# Altium schematic sheet DIO-BNC.schdoc: DIO-BNC
size 420 x 297 mm; Author: G.K.; CompanyName: WUT; DrawnBy: G.K.; Organization: CERN; Address1: Warsaw Univeristy of Technology; Address2: Nowowiejska 15/19; DocumentNumber: 1; Revision: -; SheetNumber: 1; SheetTotal: -; EDA_Number: ARTIQ; Projet: KASLI 3U subsystem; ModifiedBy: -; CreateDate: XX/XX/XXXX; CheckedDate: -; Title2: Extension board v1.2; DivGrp: ISE; Designer: G.K.; ModifiedDate: -; ProjectName: KASLI 3U subsystem
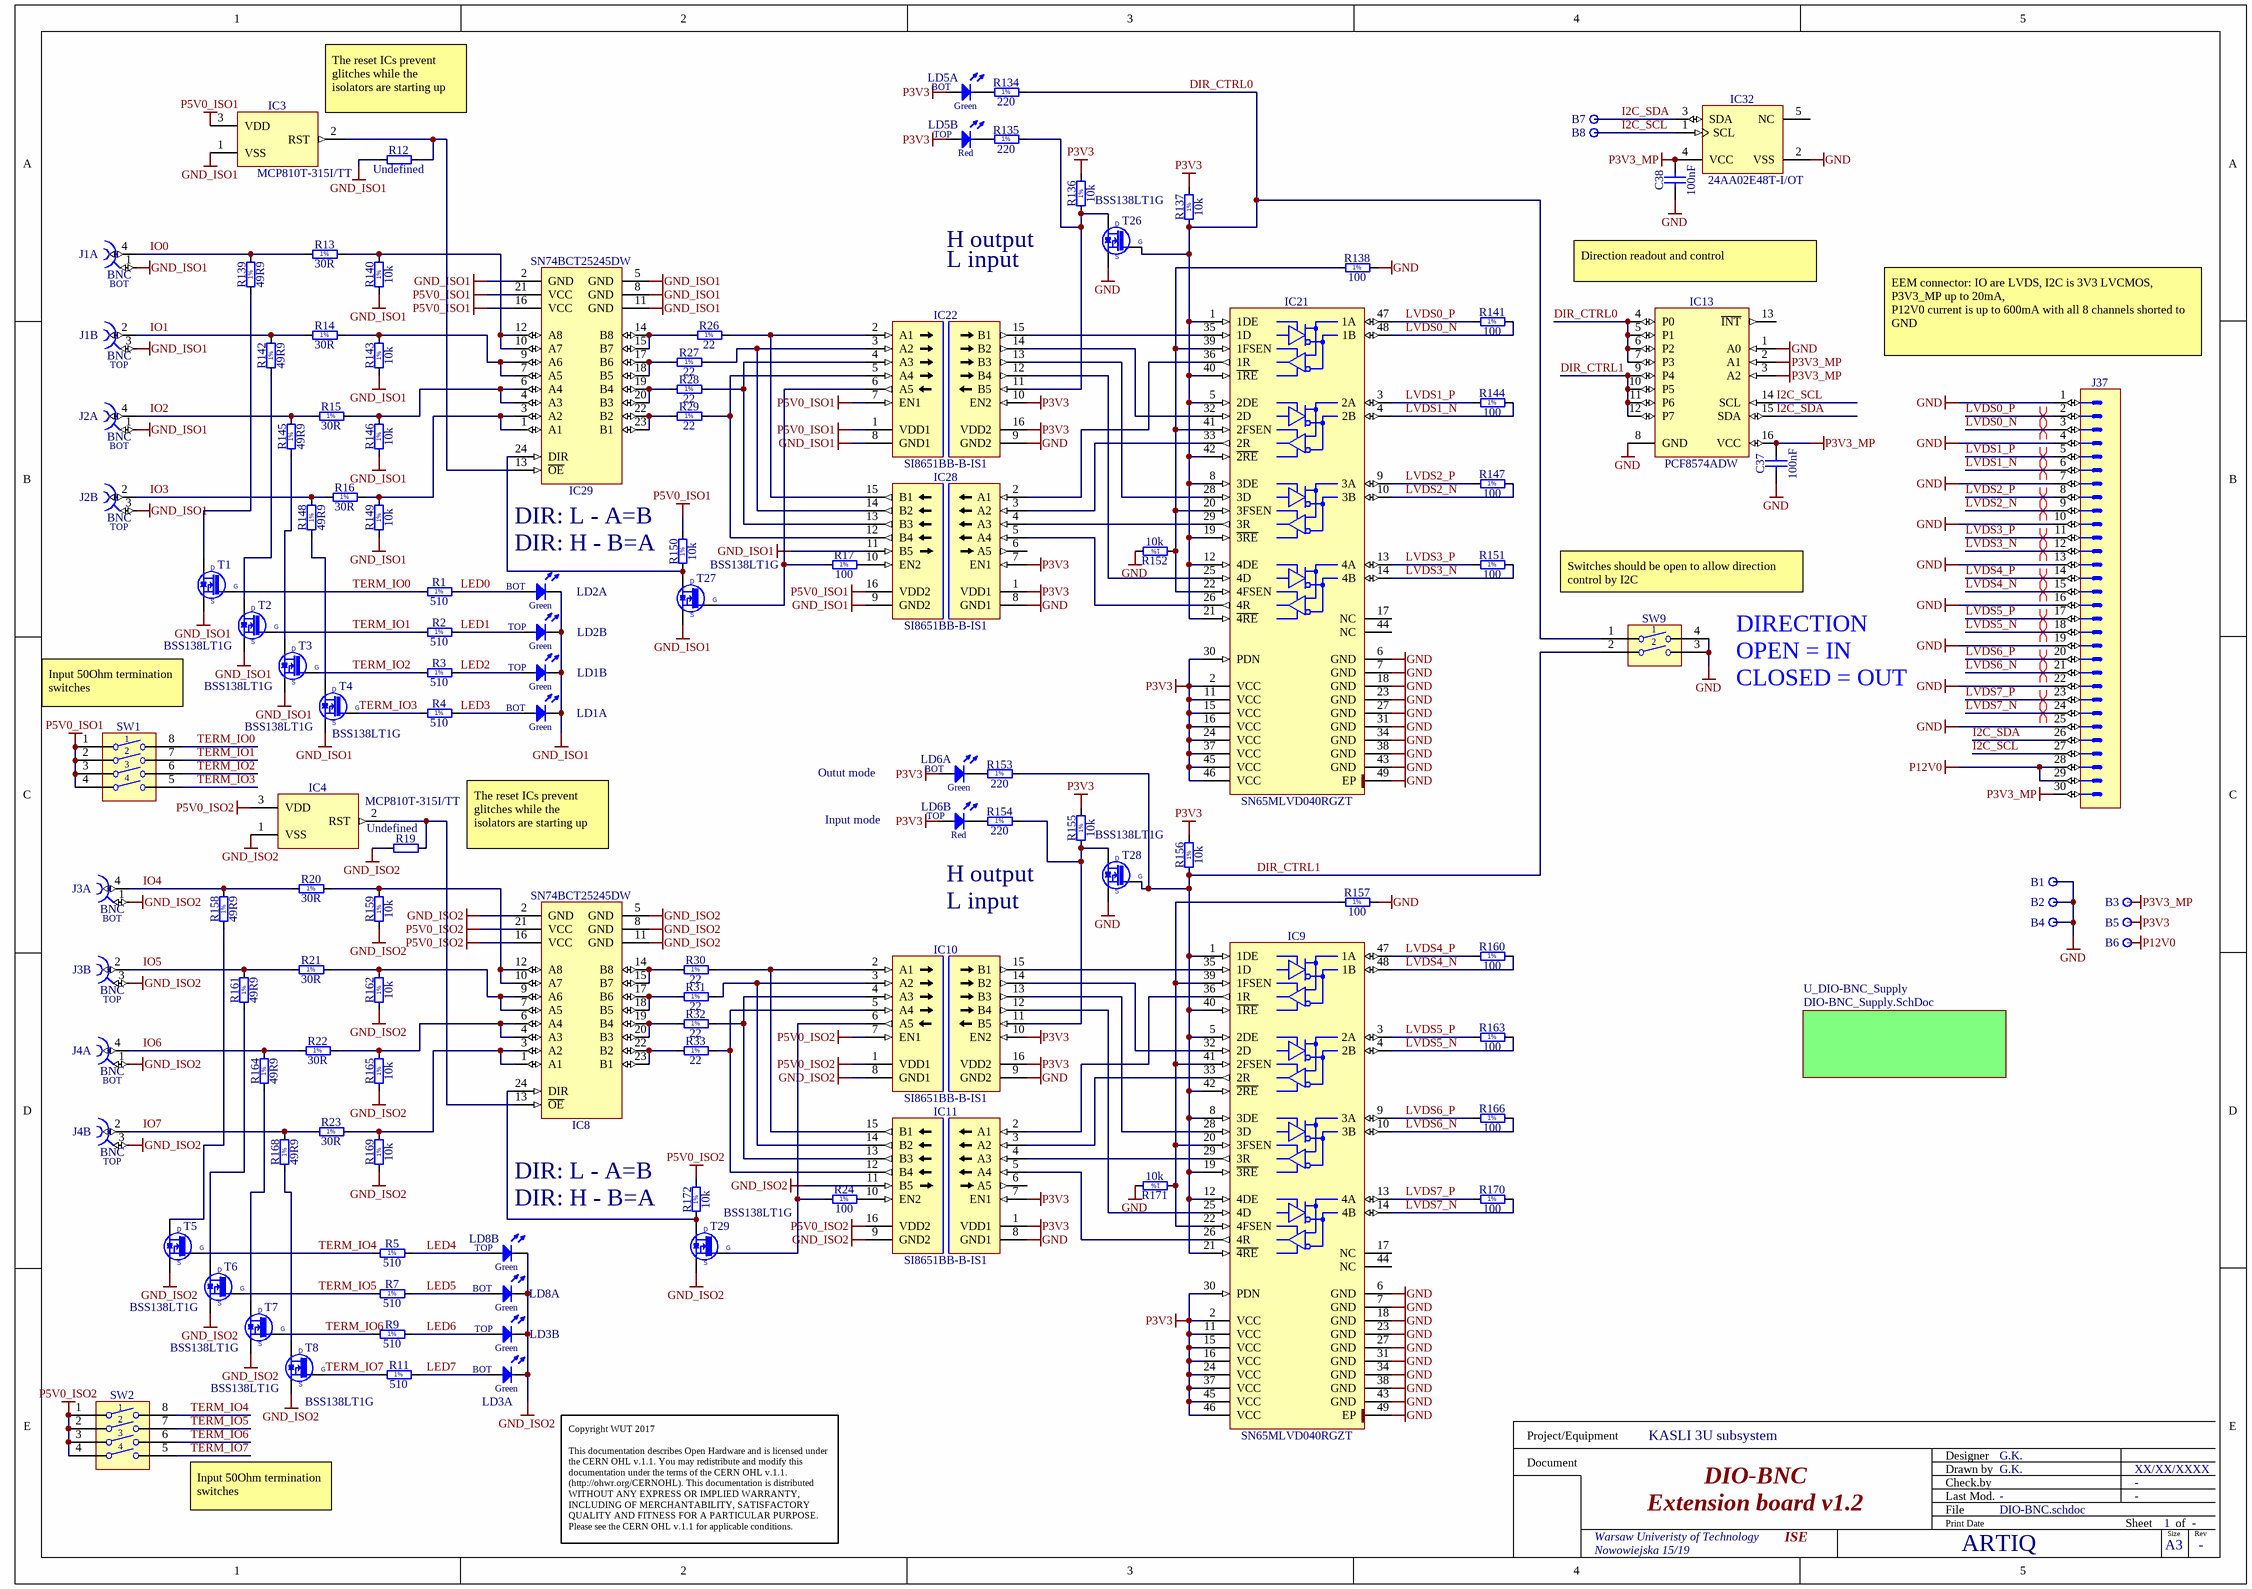
[diagram p0: DIO-BNC.schdoc]

## Parts
B1  Plated Hole  [c130h60]  (value not drawn)
B2  Plated Hole  [c130h60]  (value not drawn)
B3  Plated Hole  [c130h60]  (value not drawn)
B4  Plated Hole  [c130h60]  (value not drawn)
B5  Plated Hole  [c130h60]  (value not drawn)
B6  Plated Hole  [c130h60]  (value not drawn)
B7  Plated Hole  [c130h60]  (value not drawn)
B8  Plated Hole  [c130h60]  (value not drawn)
C37  100nF  [CAPC1005X55N]
C38  100nF  [CAPC1005X55N]
IC3  MCP810T-315I/TT  [SOT95P237X112-3N]
IC4  MCP810T-315I/TT  [SOT95P237X112-3N]
IC8  SN74BCT25245DW  [SOIC127P1030X265-24N]
IC9  SN65MLVD040RGZT  [QFN50P700X700X100-49N-S420]
IC10  SI8651BB-B-IS1  [SOIC127P600X175-16N]
IC11  SI8651BB-B-IS1  [SOIC127P600X175-16N]
IC13  PCF8574ADW  [SOIC127P1030X265-16N]
IC21  SN65MLVD040RGZT  [QFN50P700X700X100-49N-S420]
IC22  SI8651BB-B-IS1  [SOIC127P600X175-16N]
IC28  SI8651BB-B-IS1  [SOIC127P600X175-16N]
IC29  SN74BCT25245DW  [SOIC127P1030X265-24N]
IC32  24AA02E48T-I/OT  [SOT95P280X145-5N]
J1  BNC  [RENHOTEC_RHT-610-0049]  (parts A,B of 2)
J2  BNC  [RENHOTEC_RHT-610-0049]  (parts A,B of 2)
J3  BNC  [RENHOTEC_RHT-610-0049]  (parts A,B of 2)
J4  BNC  [RENHOTEC_RHT-610-0049]  (parts A,B of 2)
J37  (no value)  [3M_N2530-6002RB]
LD1  Green/Green  [LED_DIALIGHT_571-0122F]  (value not drawn)  (parts A,B of 2)
LD2  Green/Green  [LED_DIALIGHT_571-0122F]  (value not drawn)  (parts A,B of 2)
LD3  Green/Green  [LED_DIALIGHT_571-0122F]  (value not drawn)  (parts A,B of 2)
LD5  Red/Green  [LED_DIALIGHT_571-0112F]  (value not drawn)  (parts A,B of 2)
LD6  Red/Green  [LED_DIALIGHT_571-0112F]  (value not drawn)  (parts A,B of 2)
LD8  Green/Green  [LED_DIALIGHT_571-0122F]  (value not drawn)  (parts A,B of 2)
R1  510  [RESC1005X40N]
R2  510  [RESC1005X40N]
R3  510  [RESC1005X40N]
R4  510  [RESC1005X40N]
R5  510  [RESC1005X40N]
R7  510  [RESC1005X40N]
R9  510  [RESC1005X40N]
R11  510  [RESC1005X40N]
R12  Undefined  [RESC1005X40N]
R13  30R  [RESC3225X70N]
R14  30R  [RESC3225X70N]
R15  30R  [RESC3225X70N]
R16  30R  [RESC3225X70N]
R17  100  [RESC1005X40N]
R19  Undefined  [RESC1005X40N]
R20  30R  [RESC3225X70N]
R21  30R  [RESC3225X70N]
R22  30R  [RESC3225X70N]
R23  30R  [RESC3225X70N]
R24  100  [RESC1005X40N]
R26  22  [RESC1005X40N]
R27  22  [RESC1005X40N]
R28  22  [RESC1005X40N]
R29  22  [RESC1005X40N]
R30  22  [RESC1005X40N]
R31  22  [RESC1005X40N]
R32  22  [RESC1005X40N]
R33  22  [RESC1005X40N]
R134  220  [RESC1608X55N]
R135  220  [RESC1608X55N]
R136  10k  [RESC1005X40N]
R137  10k  [RESC1005X40N]
R138  100  [RESC1005X40N]
R139  49R9  [RESC3225X70N]
R140  10k  [RESC1005X40N]
R141  100  [RESC1005X40N]
R142  49R9  [RESC3225X70N]
R143  10k  [RESC1005X40N]
R144  100  [RESC1005X40N]
R145  49R9  [RESC3225X70N]
R146  10k  [RESC1005X40N]
R147  100  [RESC1005X40N]
R148  49R9  [RESC3225X70N]
R149  10k  [RESC1005X40N]
R150  10k  [RESC1005X40N]
R151  100  [RESC1005X40N]
R152  10k  [RESC1005X40N]
R153  220  [RESC1608X55N]
R154  220  [RESC1608X55N]
R155  10k  [RESC1005X40N]
R156  10k  [RESC1005X40N]
R157  100  [RESC1005X40N]
R158  49R9  [RESC3225X70N]
R159  10k  [RESC1005X40N]
R160  100  [RESC1005X40N]
R161  49R9  [RESC3225X70N]
R162  10k  [RESC1005X40N]
R163  100  [RESC1005X40N]
R164  49R9  [RESC3225X70N]
R165  10k  [RESC1005X40N]
R166  100  [RESC1005X40N]
R168  49R9  [RESC3225X70N]
R169  10k  [RESC1005X40N]
R170  100  [RESC1005X40N]
R171  10k  [RESC1005X40N]
R172  10k  [RESC1005X40N]
SW1  Switch  [SW_OMRON_A6S-4102-H]  (value not drawn)
SW2  Switch  [SW_OMRON_A6S-4102-H]  (value not drawn)
SW9  Switch  [SW_OMRON_A6S-2102-H]  (value not drawn)
T1  BSS138LT1G  [SOT95P240X110-3N]
T2  BSS138LT1G  [SOT95P240X110-3N]
T3  BSS138LT1G  [SOT95P240X110-3N]
T4  BSS138LT1G  [SOT95P240X110-3N]
T5  BSS138LT1G  [SOT95P240X110-3N]
T6  BSS138LT1G  [SOT95P240X110-3N]
T7  BSS138LT1G  [SOT95P240X110-3N]
T8  BSS138LT1G  [SOT95P240X110-3N]
T26  BSS138LT1G  [SOT95P240X110-3N]
T27  BSS138LT1G  [SOT95P240X110-3N]
T28  BSS138LT1G  [SOT95P240X110-3N]
T29  BSS138LT1G  [SOT95P240X110-3N]

## Sub-sheets
U_DIO-BNC_Supply = DIO-BNC_Supply.SchDoc: no entries

## Nets
GND: B1.1 B2.1 B4.1 C37.1 C38.1 IC9.6(GND) IC9.7(GND) IC9.18(GND) IC9.23(GND) IC9.27(GND) IC9.31(GND) IC9.34(GND) IC9.38(GND) IC9.43(GND) IC9.49(EP) IC10.9(GND2) IC11.8(GND1) IC13.1(A0) IC13.8(GND) IC21.6(GND) IC21.7(GND) IC21.18(GND) IC21.23(GND) IC21.27(GND) IC21.31(GND) IC21.34(GND) IC21.38(GND) IC21.43(GND) IC21.49(EP) IC22.9(GND2) IC28.8(GND1) IC32.2(VSS) J37.1 J37.4 J37.7 J37.10 J37.13 J37.16 J37.19 J37.22 J37.25 R138.2 R152.2 R157.2 R171.2 SW9.3 SW9.4 T26.2(S) T28.2(S)
GND_ISO1: IC3.1(VSS) IC22.8(GND1) IC28.9(GND2) IC28.11(B5) IC29.2(GND) IC29.5(GND) IC29.8(GND) IC29.11(GND) J1.1 J1.3 J2.1 J2.3 LD1.1(C) LD1.3(C) LD2.1(C) LD2.3(C) R12.1 R140.1 R143.1 R146.1 R149.1 T1.2(S) T2.2(S) T3.2(S) T4.2(S) T27.2(S)
GND_ISO2: IC4.1(VSS) IC8.2(GND) IC8.5(GND) IC8.8(GND) IC8.11(GND) IC10.8(GND1) IC11.9(GND2) IC11.11(B5) J3.1 J3.3 J4.1 J4.3 LD3.1(C) LD3.3(C) LD8.1(C) LD8.3(C) R19.1 R159.1 R162.1 R165.1 R169.1 T5.2(S) T6.2(S) T7.2(S) T8.2(S) T29.2(S)
P3V3: B5.1 IC9.2(VCC) IC9.11(VCC) IC9.15(VCC) IC9.16(VCC) IC9.24(VCC) IC9.30(PDN) IC9.37(VCC) IC9.45(VCC) IC9.46(VCC) IC10.10(EN2) IC10.16(VDD2) IC11.1(VDD1) IC11.7(EN1) IC21.2(VCC) IC21.11(VCC) IC21.15(VCC) IC21.16(VCC) IC21.24(VCC) IC21.30(PDN) IC21.37(VCC) IC21.45(VCC) IC21.46(VCC) IC22.10(EN2) IC22.16(VDD2) IC28.1(VDD1) IC28.7(EN1) LD5.2(A) LD5.4(A) LD6.2(A) LD6.4(A) R136.2 R137.2 R155.2 R156.2
P3V3_MP: B3.1 C37.2 C38.2 IC13.2(A1) IC13.3(A2) IC13.16(VCC) IC32.4(VCC) J37.30
P5V0_ISO1: IC3.3(VDD) IC22.1(VDD1) IC22.7(EN1) IC28.16(VDD2) IC29.16(VCC) IC29.21(VCC) R150.2 SW1.1 SW1.2 SW1.3 SW1.4
P5V0_ISO2: IC4.3(VDD) IC8.16(VCC) IC8.21(VCC) IC10.1(VDD1) IC10.7(EN1) IC11.16(VDD2) R172.2 SW2.1 SW2.2 SW2.3 SW2.4
P12V0: B6.1 J37.28 J37.29
DIR_CTRL0: IC13.4(P0) IC13.5(P1) IC13.6(P2) IC13.7(P3) IC21.1(1DE) IC21.5(2DE) IC21.8(3DE) IC21.12(4DE) IC21.19(~{3RE}) IC21.21(~{4RE}) IC21.40(~{1RE}) IC21.42(~{2RE}) R134.2 R137.1 SW9.1 T26.1(G)
DIR_CTRL1: IC9.1(1DE) IC9.5(2DE) IC9.8(3DE) IC9.12(4DE) IC9.19(~{3RE}) IC9.21(~{4RE}) IC9.40(~{1RE}) IC9.42(~{2RE}) IC13.9(P4) IC13.10(P5) IC13.11(P6) IC13.12(P7) R153.2 R156.1 SW9.2 T28.1(G)
I2C_SCL: B8.1 IC13.14(SCL) IC32.1(SCL) J37.27
I2C_SDA: B7.1 IC13.15(SDA) IC32.3(SDA) J37.26
IO0: J1.4 R13.1 R139.2
IO1: J1.2 R14.1 R142.2
IO2: J2.4 R15.1 R145.2
IO3: J2.2 R16.1 R148.2
IO4: J3.4 R20.1 R158.2
IO5: J3.2 R21.1 R161.2
IO6: J4.4 R22.1 R164.2
IO7: J4.2 R23.1 R168.2
LED0: LD2.2(A) R1.2
LED1: LD2.4(A) R2.2
LED2: LD1.4(A) R3.2
LED3: LD1.2(A) R4.2
LED4: LD8.4(A) R5.2
LED5: LD8.2(A) R7.2
LED6: LD3.4(A) R9.2
LED7: LD3.2(A) R11.2
LVDS0_N: IC21.48(1B) J37.3 R141.2
LVDS0_P: IC21.47(1A) J37.2 R141.1
LVDS1_N: IC21.4(2B) J37.6 R144.2
LVDS1_P: IC21.3(2A) J37.5 R144.1
LVDS2_N: IC21.10(3B) J37.9 R147.2
LVDS2_P: IC21.9(3A) J37.8 R147.1
LVDS3_N: IC21.14(4B) J37.12 R151.2
LVDS3_P: IC21.13(4A) J37.11 R151.1
LVDS4_N: IC9.48(1B) J37.15 R160.2
LVDS4_P: IC9.47(1A) J37.14 R160.1
LVDS5_N: IC9.4(2B) J37.18 R163.2
LVDS5_P: IC9.3(2A) J37.17 R163.1
LVDS6_N: IC9.10(3B) J37.21 R166.2
LVDS6_P: IC9.9(3A) J37.20 R166.1
LVDS7_N: IC9.14(4B) J37.24 R170.2
LVDS7_P: IC9.13(4A) J37.23 R170.1
TERM_IO0: R1.1 SW1.8 T1.1(G)
TERM_IO1: R2.1 SW1.7 T2.1(G)
TERM_IO2: R3.1 SW1.6 T3.1(G)
TERM_IO3: R4.1 SW1.5 T4.1(G)
TERM_IO4: R5.1 SW2.8 T5.1(G)
TERM_IO5: R7.1 SW2.7 T6.1(G)
TERM_IO6: R9.1 SW2.6 T7.1(G)
TERM_IO7: R11.1 SW2.5 T8.1(G)
NetIC3_2: IC3.2(RST) IC29.13(~{OE}) R12.2
NetIC4_2: IC4.2(RST) IC8.13(~{OE}) R19.2
NetIC8_1: IC8.1(A1) IC8.3(A2) R23.2 R169.2
NetIC8_4: IC8.4(A3) IC8.6(A4) R22.2 R165.2
NetIC8_7: IC8.7(A5) IC8.9(A6) R21.2 R162.2
NetIC8_10: IC8.10(A7) IC8.12(A8) R20.2 R159.2
NetIC8_14: IC8.14(B8) IC8.15(B7) R30.1
NetIC8_17: IC8.17(B6) IC8.18(B5) R31.1
NetIC8_19: IC8.19(B4) IC8.20(B3) R32.1
NetIC8_22: IC8.22(B2) IC8.23(B1) R33.1
NetIC8_24: IC8.24(DIR) R172.1 T29.3(D)
NetIC9_20: IC9.20(3FSEN) IC9.22(4FSEN) IC9.39(1FSEN) IC9.41(2FSEN) R157.1 R171.1
NetIC9_25: IC9.25(4D) IC10.12(B4)
NetIC9_26: IC9.26(4R) IC11.5(A4)
NetIC9_28: IC9.28(3D) IC10.13(B3)
NetIC9_29: IC9.29(3R) IC11.4(A3)
NetIC9_32: IC9.32(2D) IC10.14(B2)
NetIC9_33: IC9.33(2R) IC11.3(A2)
NetIC9_35: IC9.35(1D) IC10.15(B1)
NetIC9_36: IC9.36(1R) IC11.2(A1)
NetIC10_2: IC10.2(A1) IC11.15(B1) R30.2
NetIC10_3: IC10.3(A2) IC11.14(B2) R31.2
NetIC10_4: IC10.4(A3) IC11.13(B3) R32.2
NetIC10_5: IC10.5(A4) IC11.12(B4) R33.2
NetIC10_6: IC10.6(A5) R24.1 T29.1(G)
NetIC10_11: IC10.11(B5) R154.2 R155.1 T28.3(D)
NetIC11_10: IC11.10(EN2) R24.2
NetIC21_20: IC21.20(3FSEN) IC21.22(4FSEN) IC21.39(1FSEN) IC21.41(2FSEN) R138.1 R152.1
NetIC21_25: IC21.25(4D) IC22.12(B4)
NetIC21_26: IC21.26(4R) IC28.5(A4)
NetIC21_28: IC21.28(3D) IC22.13(B3)
NetIC21_29: IC21.29(3R) IC28.4(A3)
NetIC21_32: IC21.32(2D) IC22.14(B2)
NetIC21_33: IC21.33(2R) IC28.3(A2)
NetIC21_35: IC21.35(1D) IC22.15(B1)
NetIC21_36: IC21.36(1R) IC28.2(A1)
NetIC22_2: IC22.2(A1) IC28.15(B1) R26.2
NetIC22_3: IC22.3(A2) IC28.14(B2) R27.2
NetIC22_4: IC22.4(A3) IC28.13(B3) R28.2
NetIC22_5: IC22.5(A4) IC28.12(B4) R29.2
NetIC22_6: IC22.6(A5) R17.1 T27.1(G)
NetIC22_11: IC22.11(B5) R135.2 R136.1 T26.3(D)
NetIC28_10: IC28.10(EN2) R17.2
NetIC29_1: IC29.1(A1) IC29.3(A2) R16.2 R149.2
NetIC29_4: IC29.4(A3) IC29.6(A4) R15.2 R146.2
NetIC29_7: IC29.7(A5) IC29.9(A6) R14.2 R143.2
NetIC29_10: IC29.10(A7) IC29.12(A8) R13.2 R140.2
NetIC29_14: IC29.14(B8) IC29.15(B7) R26.1
NetIC29_17: IC29.17(B6) IC29.18(B5) R27.1
NetIC29_19: IC29.19(B4) IC29.20(B3) R28.1
NetIC29_22: IC29.22(B2) IC29.23(B1) R29.1
NetIC29_24: IC29.24(DIR) R150.1 T27.3(D)
NetLD5_1: LD5.1(C) R134.1
NetLD5_3: LD5.3(C) R135.1
NetLD6_1: LD6.1(C) R153.1
NetLD6_3: LD6.3(C) R154.1
NetR139_1: R139.1 T1.3(D)
NetR142_1: R142.1 T2.3(D)
NetR145_1: R145.1 T3.3(D)
NetR148_1: R148.1 T4.3(D)
NetR158_1: R158.1 T5.3(D)
NetR161_1: R161.1 T6.3(D)
NetR164_1: R164.1 T7.3(D)
NetR168_1: R168.1 T8.3(D)

Not connected (* = marked no-connect by the designer): IC9 17(NC) 44(NC); IC11 6(A5); IC13 13(~{INT}); IC21 17(NC) 44(NC); IC28 6(A5); IC32 5(NC)

## Layout directives
differential pair: LVDS0_N, LVDS0_P, LVDS1_N, LVDS1_P, LVDS2_N, LVDS2_P, LVDS3_N, LVDS3_P, LVDS4_N, LVDS4_P, LVDS5_N, LVDS5_P, LVDS6_N, LVDS6_P, LVDS7_N, LVDS7_P

## Notes on the sheet
- (near IC3) The reset ICs prevent glitches while the isolators are starting up
- H output
- L input
- Direction readout and control
- (near J37) EEM connector: IO are LVDS, I2C is 3V3 LVCMOS, P3V3_MP up to 20mA,
  P12V0 current is up to 600mA with all 8 channels shorted to GND
- DIR: L - A=B
- DIR: H - B=A
- Switches should be open to allow direction control by I2C
- DIRECTION
- OPEN = IN
- (near SW1) Input 50Ohm termination switches
- CLOSED = OUT
- Outut mode
- The reset ICs prevent glitches while the isolators are starting up
- Input mode
- (near SW2) Input 50Ohm termination switches
- Copyright WUT 2017
  This documentation describes Open Hardware and is licensed under the CERN OHL v.1.1. You may redistribute and modify this documentation under the terms of the CERN OHL v.1.1. (http://ohwr.org/CERNOHL). This documentation is distributed WITHOUT ANY EXPRESS OR IMPLIED WARRANTY, INCLUDING OF MERCHANTABILITY, SATISFACTORY QUALITY AND FITNESS FOR A PARTICULAR PURPOSE. Please see the CERN OHL v.1.1 for applicable conditions.
- Project/Equipment
- Document
- Designer
- Drawn by
- Check.by
- File
- Last Mod.
- Print Date
- Sheet
- Size
- A3
- of
- Rev
- (in symbol CON_BNC_DUAL, part A) BOT
- (in symbol CON_BNC_DUAL, part B) TOP
- (in symbol LED_DIALIGHT_571-0112F, part A) BOT; Green
- (in symbol LED_DIALIGHT_571-0112F, part B) TOP; Red
- (in symbol LED_DIALIGHT_571-0122F, part A) BOT; Green
- (in symbol LED_DIALIGHT_571-0122F, part B) TOP; Green
- (in symbol R0402_10K_1%_0.0625W_100PPM) 1%
- (in symbol R0402_22R_1%_0.0625W_100PPM) 1%
- (in symbol R0402_100R_1%_0.1W_100PPM) 1%
- (in symbol R0402_510R_1%_0.0625W_100PPM) 1%
- (in symbol R0603_220R_1%_0.1W_100PPM) 1%
- (in symbol R1210_30R_5%_0.5W_200PPM) 1%
- (in symbol R1210_49R9_1%_0.5W_100PPM_VISHAY_CRCW) 1%

## Library data of the parts
B1-B8 = PLATED_HOLE0.6_PAD1.3: Single Terminal Socket; Part Description: Plated Through Hole: Hole Dia.=0.6mm Pad Dia.=1.3mm; Mounted: No; Part Number: PLATED_HOLE0.6_PAD1.3; Component Kind: Standard (No BOM); Component Type: Standard (No BOM); Pin Count: 1; Family: Plated Hole; Socket: No; SMD: No; Sense: No; Status: None; ComponentHeight: 0mm; HelpURL: Undefined; Author: CERN DEM MR; CreateDate: 02.03.2016; LatestRevisionDate: 02.03.2016; PackageDescription: Plated Through Hole: Hole Dia.=0.6mm Pad Dia.=1.3mm
C37 C38 = CC0402_100NF_16V_10%_X5R: Non-polarised capacitor; Part Description: SMD Multilayer Chip Ceramic Capacitor; Manufacturer: GENERIC; Manufacturer1 Part Number: GRM155R61C104KA88D; Voltage: 16V; TC: X5R; Tolerance: ±10%; Part Number: CC0402_100NF_16V_10%_X5R; Component Kind: Standard; Component Type: Standard; Pin Count: 2; Value: 100nF; Status: None; Manufacturer Part Number: CC0402_100NF_16V_10%_X5R; Case: 0402; Mounted: Yes; Socket: No; SMD: Yes; Sense: No; Manufacturer1 Example: MURATA; Manufacturer1 ComponentHeight: 0.55mm; HelpURL: \\cern.ch\dfs\Applications\Altium\Datasheets\CC0402_X5R_MURATA_GRM.pdf; Author: CERN DEM JLC; CreateDate: 10.12.2013; LatestRevisionDate: 10.12.2013
IC3 IC4 = VMON_MCP810: 3.075V Microcontroller Supervisory Circuit With Push-Pull Output; Manufacturer: MICROCHIP TECHNOLOGY; PressFit: No; Bonding: No; Part Number: MCP810T-315I/TT; Component Kind: Standard; Component Type: Standard; Device: MCP810T-315I/TT; PackageDescription: SOT, 0.95mm, pitch; 3 pin,1.30mm W X 2.92mm L X 1.12mm H body, IPC Medium Density; Part Description: 3.075V Microcontroller Supervisory Circuit With Push-Pull Output; Manufacturer Part Number: MCP810T-315I/TT; Pin Count: 3; Case: SOT23; Mounted: Yes; Socket: No; SMD: Yes; Sense: No; ComponentHeight: 1.12mm; Author: GK; HelpURL: \\cern.ch\dfs\Applications\Altium\Datasheets\MCP809T-315I-TT.pdf; CreateDate: 16.06.2011; LatestRevisionDate: 16.06.2011
IC8 IC29 = SN74BCT25245DW: 25 Ohms Octal Bus Transceiver With 3-State Outputs; Manufacturer: TEXAS INSTRUMENTS; PressFit: No; Bonding: No; Part Number: SN74BCT25245DW; Component Kind: Standard; Component Type: Standard; Device: SN74BCT25245DW; PackageDescription: SOIC 24, Pitch 1.27mm - Body 7.6x15.6mm, IPC Medium Density; Part Description: 25 Ohms Octal Bus Transceiver With 3-State Outputs; Manufacturer Part Number: SN74BCT25245DW; Pin Count: 24; Case: SOIC24; Mounted: Yes; Socket: No; SMD: Yes; Sense: No; ComponentHeight: 2.65mm; Author: CERN DEM JLC; HelpURL: \\cern.ch\dfs\Applications\Altium\Datasheets\SN74BCT25245DW.pdf; CreateDate: 09.11.2009; LatestRevisionDate: 09.11.2009
IC9 IC21 = SN65MLVD040RGZT: 4-Channel Half-Duplex M-LVDS Line Transceiver; Manufacturer: TEXAS INSTRUMENTS; PressFit: No; Bonding: No; Part Number: SN65MLVD040RGZT; Component Kind: Standard; Component Type: Standard; Device: SN65MLVD040RGZT; PackageDescription: QFN, 0.50mm Pitch, Square; 48 Pin, 7.00mm L X 7.00mm W X 1mm H body (W/Thermal Tab 4.2mm X 4.2mm), IPC Medium Density; Part Description: 4-Channel Half-Duplex M-LVDS Line Transceiver; Manufacturer Part Number: SN65MLVD040RGZT; Pin Count: 49; Case: QFN48; Mounted: Yes; Socket: No; SMD: Yes; Sense: No; ComponentHeight: 1mm; Author: CERN DEM JLC; HelpURL: \\cern.ch\dfs\Applications\Altium\Datasheets\SN65MLVD040RGZT.pdf; CreateDate: 17.03.2011; LatestRevisionDate: 17.03.2011
IC10 IC11 IC22 IC28 = SI8651BB-B-IS1: Low Power Five-Channel Digital Isolator; Part Description: 2.5kV 150Mbps Low Power Five-Channel Digital Isolator; Manufacturer: SILICON LABS; PressFit: No; Bonding: No; Part Number: SI8651BB-B-IS1; Component Kind: Standard; Component Type: Standard; Device: SI8651BB-B-IS1; PackageDescription: SOIC 16, Pitch 1.27mm - Body 4x10mm, IPC Medium Density; Manufacturer Part Number: SI8651BB-B-IS1; Pin Count: 16; Case: SOIC16; Mounted: Yes; Socket: No; SMD: Yes; Sense: No; ComponentHeight: 1.75mm; Author: CERN DEM JLC; HelpURL: \\cern.ch\dfs\Applications\Altium\Datasheets\SI8651BB-B-IS1.pdf; CreateDate: 31.10.2013; LatestRevisionDate: 31.10.2013
IC13 = PCF8574ADW: Remote 8-bit I/O Expander For I2C Bus; Manufacturer: TEXAS INSTRUMENTS; PressFit: No; Bonding: No; Part Number: PCF8574ADW; Component Kind: Standard; Component Type: Standard; Device: PCF8574ADW; PackageDescription: SOIC 16, Pitch 1.27mm - Body 7.5x10.3mm, IPC Medium Density; Part Description: Remote 8-bit I/O Expander For I2C Bus; Manufacturer Part Number: PCF8574ADW; Pin Count: 16; Case: SOIC16W; Mounted: Yes; Socket: No; SMD: Yes; Sense: No; ComponentHeight: 2.65mm; Author: CERN DEM JLC; HelpURL: \\cern.ch\dfs\Applications\Altium\Datasheets\PCF8574ADW.pdf; CreateDate: 01.11.2012; LatestRevisionDate: 01.11.2012
IC32 = 24AA02E48T-I/OT: 1.7V-5.5V, 2K I2C Serial EEPROM With EUI-48 Node Identity; Manufacturer: MICROCHIP TECHNOLOGY; PressFit: No; Bonding: No; Part Number: 24AA02E48T-I/OT; Component Kind: Standard; Component Type: Standard; Device: 24AA02E48T-I/OT; PackageDescription: SOT, 0.95mm pitch; 5 pin, 1.60mm W X 2.90mm L X 1.45mm H body, IPC Medium Density; Part Description: 1.7V-5.5V, 2K I2C Serial EEPROM With EUI-48 Node Identity; Manufacturer Part Number: 24AA02E48T-I/OT; Pin Count: 5; Case: SOT23-5; Mounted: Yes; Socket: No; SMD: Yes; Sense: No; ComponentHeight: 1.45mm; HelpURL: \\cern.ch\dfs\Applications\Altium\Datasheets\24AA02E48T-I-OT.pdf; Author: CERN DEM MR; CreateDate: 31.03.2016; LatestRevisionDate: 31.03.2016
J1-J4 = CON_BNC_DUAL: Dual Right Angle 50 Ohm BNC Jack, White Valox Case; Manufacturer: RENHOTEC; Manufacturer Part Number: RHT-610-0049; PressFit: No; Part Number: RENHOTEC_RHT-610-0049; Component Kind: Standard; Component Type: Standard; Pin Count: 6; Family: BNC; Mounted: Yes; Socket: No; SMD: No; Sense: No; Status: None; Part Description: Dual Right Angle 50 Ohm BNC Jack, White Valox Case; ComponentHeight: 29.3mm; HelpURL: \\cern.ch\dfs\Applications\Altium\Datasheets\BOMAR_364A2595.pdf; Author: GK; CreateDate: 09.04.2013; LatestRevisionDate: 09.04.2013
J37 = 3M_N2530-6002RB: Connector 30 Male; Part Description: 30 Contacts - Straight .100'' x .100'' Low Profile Four-Wall Header, 2500 Series; Manufacturer: 3M; PressFit: No; Part Number: 3M_N2530-6002RB; Component Kind: Standard; Component Type: Standard; Pin Count: 30; Family: Header 30; Mounted: Yes; Socket: No; SMD: No; Sense: No; Status: None; Manufacturer Part Number: N2530-6002RB; ComponentHeight: 10.03mm; HelpURL: \\cern.ch\dfs\Applications\Altium\Datasheets\3M_N2530-6002RB.pdf; Author: CERN DEM JLC; CreateDate: 11.02.2009; LatestRevisionDate: 11.08.2009
LD1-LD3 LD8 = LED_DIALIGHT_571-0122F: LED x2 Green 1C2A-BOT_3C4A-TOP; Part Description: Dual 2mm Green LEDs CBI® Circuit Board Indicator (Without positioning pins); PressFit: No; Bonding: No; Part Number: LED_DIALIGHT_571-0122F; Component Kind: Standard; Component Type: Standard; Color: Green/Green; PackageDescription: 2x 2mm Red LED PCB Edge Mounting (Without positioning pins) DIALIGHT 571 Serie; Manufacturer: DIALIGHT; Manufacturer Part Number: 571-0122F; Pin Count: 4; Mounted: Yes; Socket: No; SMD: No; Sense: No; ComponentHeight: 8.6mm; HelpURL: \\cern.ch\dfs\Applications\Altium\Datasheets\LED_DIALIGHT_571-0122F.pdf; Author: CERN DEM JLC; CreateDate: 09.11.2009; LatestRevisionDate: 17.03.2010
LD5 LD6 = LED_DIALIGHT_571-0112F: 2x LED  Botom Green, Top Red; Part Description: Dual 2mm  LEDs, Red Top,Green Bot, CBI® Circuit Board Indicator (Without positioning pins); PressFit: No; Bonding: No; Part Number: LED_DIALIGHT_571-0112F; Component Kind: Standard; Component Type: Standard; Color: Red/Green; PackageDescription: 2x 2mm LED (Top: Red, Bot: Green) PCB Edge Mounting (Without positioning pins) DIALIGHT 571 Serie; Manufacturer: DIALIGHT; Manufacturer Part Number: 571-0112F; Pin Count: 4; Mounted: Yes; Socket: No; SMD: No; Sense: No; ComponentHeight: 8.6mm; HelpURL: \\cern.ch\dfs\Applications\Altium\Datasheets\LED_DIALIGHT_571-0112F.pdf; Author: CERN DEM JLC; CreateDate: 09.11.2009; LatestRevisionDate: 17.03.2010
R1-R5 R7 R9 R11 = R0402_510R_1%_0.0625W_100PPM: Resistor - 1%; Part Description: General Purpose Thick Film Chip Resistor; Manufacturer: GENERIC; Manufacturer1 Part Number: 232270675101L; TC: ±100ppm/°C; Part Number: R0402_510R_1%_0.0625W_100PPM; Component Kind: Standard; Component Type: Standard; Pin Count: 2; Value: 510; Status: Not recommended; Power: 0.0625W; Tolerance: ±1%; Manufacturer Part Number: R0402_510R_1%_0.0625W_100PPM; Case: 0402; Mounted: Yes; Sense: No; Socket: No; SMD: Yes; Manufacturer1 Example: YAGEO PHYCOMP; Manufacturer1 ComponentHeight: 0.4mm; HelpURL: \\cern.ch\dfs\Applications\Altium\Datasheets\R0402_Phycomp_RC0402.pdf; Author: CERN DEM JLC; CreateDate: 03.12.2007; LatestRevisionDate: 17.10.2012
R12 R19 = R0402_NO-VALUE: Resistor; Part Description: Reserved Footprint For a 0402 (1005) Chip Resistor; PressFit: No; Mounted: No; Part Number: R0402_NO-VALUE; Component Kind: Standard; Component Type: Standard; Pin Count: 2; Value: Undefined; Status: None; Manufacturer: Undefined; Manufacturer Part Number: R0402_NO-VALUE; Case: 0402; Sense: No; Socket: No; SMD: Yes; Manufacturer1 Example: Undefined; Manufacturer1 Part Number: Undefined; Manufacturer1 ComponentHeight: Undefined; HelpURL: Undefined; Author: CERN DEM JLC; CreateDate: 03.12.2007; LatestRevisionDate: 13.03.2008
R13-R16 R20-R23 = R1210_30R_5%_0.5W_200PPM: Resistor - 5%; Part Description: Thick Film Chip Resistor; Manufacturer: VISHAY; Manufacturer Part Number: CRCW121030R0JNEA; Power: 0.5W; TC: ±200ppm/°C; PressFit: No; Part Number: R1210_30R_5%_0.5W_200ppm; Component Kind: Standard; Component Type: Standard; Pin Count: 2; Value: 30R; Status: None; Tolerance: ±5%; Case: 1210; Mounted: Yes; Sense: No; Socket: No; SMD: Yes; HelpURL: \\cern.ch\dfs\Applications\Altium\Datasheets\R1210_VISHAY_CRCW1210.pdf; Author: CERN DEM JMW; CreateDate: 06.08.2014; LatestRevisionDate: 06.08.2014; ComponentHeight: 0.6mm
R17 R24 R138 R141 R144 R147 R151 R157 R160 R163 R166 R170 = R0402_100R_1%_0.1W_100PPM: Resistor - 1%; Part Description: General Purpose Thick Film Chip Resistor; Manufacturer: GENERIC; Manufacturer Part Number: R0402_100R_1%_0.1W_100PPM_50V; Manufacturer1 Part Number: ERJ2RKF1000X; Power: 0.1W; TC: ±100ppm/°C; Voltage: 50V; Part Number: R0402_100R_1%_0.1W_100PPM; Component Kind: Standard; Component Type: Standard; Pin Count: 2; Value: 100; Status: Not recommended; Tolerance: ±1%; Case: 0402; Mounted: Yes; Sense: No; Socket: No; SMD: Yes; Manufacturer1 Example: PANASONIC; Manufacturer1 ComponentHeight: 0.4mm; HelpURL: \\cern.ch\dfs\Applications\Altium\Datasheets\R0402_PANASONIC_ERJ2RK.pdf; Author: CERN DEM JLC; CreateDate: 12.12.2013; LatestRevisionDate: 03.03.2015
R26-R33 = R0402_22R_1%_0.0625W_100PPM: Resistor - 1%; Part Description: General Purpose Thick Film Chip Resistor; Manufacturer: GENERIC; Manufacturer1 Part Number: 232270672209L; TC: ±100ppm/°C; PressFit: No; Part Number: R0402_22R_1%_0.0625W_100PPM; Component Kind: Standard; Component Type: Standard; Pin Count: 2; Value: 22; Status: Not Recommended; Power: 0.0625W; Tolerance: ±1%; Manufacturer Part Number: R0402_22R_1%_0.0625W_100PPM; Case: 0402; Mounted: Yes; Sense: No; Socket: No; SMD: Yes; Manufacturer1 Example: YAGEO PHYCOMP; Manufacturer1 ComponentHeight: 0.4mm; HelpURL: \\cern.ch\dfs\Applications\Altium\Datasheets\R0402_Phycomp_RC0402.pdf; Author: CERN DEM JLC; CreateDate: 03.12.2007; LatestRevisionDate: 17.10.2012
R134 R135 R153 R154 = R0603_220R_1%_0.1W_100PPM: Resistor - 1%; Part Description: General Purpose Thick Film Chip Resistor; Manufacturer: GENERIC; Manufacturer1 Part Number: NRC06F2200TRF; Power: 0.1W; TC: ±100ppm/°C; Part Number: R0603_220R_1%_0.1W_100PPM; Component Kind: Standard; Component Type: Standard; Pin Count: 2; Value: 220; Status: Preferred; Tolerance: ±1%; Manufacturer Part Number: R0603_220R_1%_0.1W_100PPM; Case: 0603; Mounted: Yes; Sense: No; Socket: No; SMD: Yes; Manufacturer1 Example: NIC COMPONENT; Manufacturer1 ComponentHeight: 0.55mm; HelpURL: \\cern.ch\dfs\Applications\Altium\Datasheets\R0603_NIC_NRC.pdf; Author: CERN DEM JLC; CreateDate: 03.12.2007; LatestRevisionDate: 13.03.2008
R136 R137 R140 R143 R146 R149 R150 R152 R155 R156 R159 R162 R165 R169 R171 R172 = R0402_10K_1%_0.0625W_100PPM: Resistor - 1%; Part Description: General Purpose Thick Film Chip Resistor; Manufacturer: GENERIC; Manufacturer1 Part Number: 232270671003L; TC: ±100ppm/°C; Part Number: R0402_10K_1%_0.0625W_100PPM; Component Kind: Standard; Component Type: Standard; Pin Count: 2; Value: 10k; Status: Not recommended; Power: 0.0625W; Tolerance: ±1%; Manufacturer Part Number: R0402_10K_1%_0.0625W_100PPM; Case: 0402; Mounted: Yes; Sense: No; Socket: No; SMD: Yes; Manufacturer1 Example: YAGEO PHYCOMP; Manufacturer1 ComponentHeight: 0.4mm; HelpURL: \\cern.ch\dfs\Applications\Altium\Datasheets\R0402_Phycomp_RC0402.pdf; Author: CERN DEM JLC; CreateDate: 03.12.2007; LatestRevisionDate: 17.10.2012
R139 R142 R145 R148 R158 R161 R164 R168 = R1210_49R9_1%_0.5W_100PPM_VISHAY_CRCW: Resistor - 1%; Part Description: Thick Film Chip Resistor; Manufacturer: VISHAY DRALORIC; Manufacturer Part Number: CRCW121049R9FKTA; Power: 0.5W; TC: ±100ppm/°C; Part Number: R1210_49R9_1%_0.5W_100PPM_VISHAY_CRCW; Component Kind: Standard; Component Type: Standard; Pin Count: 2; Value: 49R9; Status: None; Tolerance: ±1%; Case: 1210; Mounted: Yes; Sense: No; Socket: No; SMD: Yes; ComponentHeight: 0.6mm; HelpURL: \\cern.ch\dfs\Applications\Altium\Datasheets\R1210_VISHAY_CRCW1210.pdf; Author: CERN DEM JMW; CreateDate: 06.08.2014; LatestRevisionDate: 06.08.2014
SW1 SW2 = SW_OMRON_A6S-4102-H: 4 Ways SPST DIP Switch; Part Description: 4 Ways SPST DIP Switch, White Flat Actuator with Seal Tape, Contact Rating 25mA 24VDC; Manufacturer: OMRON; PressFit: No; Part Number: SW_OMRON_A6S-4102-H; Component Kind: Standard; Component Type: Standard; Pin Count: 8; PackageDescription: Pitch 2.54mm, Body 11.3x6.4mm, 4 Ways SPST Surface-Mounting DIP Switch, OMRON A6S-H; Family: Switch; Mounted: Yes; Socket: No; SMD: Yes; Sense: No; Status: None; Manufacturer Part Number: A6S-4102-H; ComponentHeight: 3.8mm; HelpURL: \\cern.ch\dfs\Applications\Altium\Datasheets\SW_OMRON_A6S-4102-H.pdf; Author: CERN DEM JMW; CreateDate: 25.09.2008; LatestRevisionDate: 25.09.2008
SW9 = SW_OMRON_A6S-2102-H: 2 Ways SPST DIP Switch; Part Description: 2 Ways SPST DIP Switch, White Flat Actuator with Seal Tape, Contact Rating 25mA 24VDC; Manufacturer: OMRON; PressFit: No; Part Number: SW_OMRON_A6S-2102-H; Component Kind: Standard; Component Type: Standard; Pin Count: 4; PackageDescription: Pitch 2.54mm, Body 6.2x6.4mm, 2 Ways SPST Surface-Mounting DIP Switch, OMRON A6S-H; Family: Switch; Mounted: Yes; Socket: No; SMD: Yes; Sense: No; Status: None; Manufacturer Part Number: A6S-2102-H; ComponentHeight: 3.8mm; HelpURL: \\cern.ch\dfs\Applications\Altium\Datasheets\SW_OMRON_A6S-2102-H.pdf; Author: CERN DEM JMW; CreateDate: 25.09.2008; LatestRevisionDate: 25.09.2008
T1-T8 T26-T29 = BSS138LT1G: N-CHANNEL MOSFET WITH DIODE; Part Description: 50V 200mA N-Channel Enhancement Mode Field-Effect Transistor; Manufacturer: ON SEMICONDUCTOR; PressFit: No; Bonding: No; Part Number: BSS138LT1G; Component Kind: Standard; Component Type: Standard; Device: BSS138LT1G; PackageDescription: SOT23 3-Leads, Pitch 0.95mm - Body 1.4x3mm, IPC Medium Density; Manufacturer Part Number: BSS138LT1G; Pin Count: 3; Case: SOT23-3; Mounted: Yes; Socket: No; SMD: Yes; Sense: No; ComponentHeight: 1.11mm; HelpURL: \\cern.ch\dfs\Applications\Altium\Datasheets\BSS138LT1G.pdf; Author: CERN DEM JLC; CreateDate: 23.03.2009; LatestRevisionDate: 23.03.2009